# EAGLE schematic ESP-12F Programming Board (EAGLE 7.6.0)
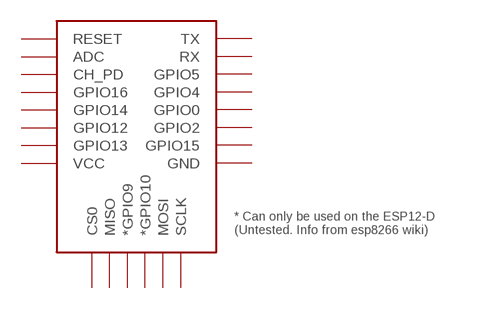
[diagram p0: schematic, sheet 1]

## Parts
U1  ESP12ESMD  [ESP12E-SMD]
Unconnected: U1.ADC U1.CH_PD U1.CS0 U1.GND U1.GPIO0 U1.GPIO2 U1.GPIO4 U1.GPIO5 U1.GPIO9(*GPIO9) U1.GPIO10(*GPIO10) U1.GPIO12 U1.GPIO13 U1.GPIO14 U1.GPIO15 U1.GPIO16 U1.MISO U1.MOSI U1.RESET U1.RXD0(RX) U1.SCLK U1.TXD0(TX) U1.VCC

## Library data of the parts
U1 = esp8266modules:ESP12E: ESP12E Module